# EasyEDA Pro project TY_FC_13.eprj

# Schematic Schematic1
Board Name: Board1; Create Date: 2026-01-26; Page Name: P1; Project Name: TY_FC_13; Schematic Name: Schematic1; Update Date: 2026-05-01; Company: 嘉立创EDA; Page Size: A4; Version: V1.0
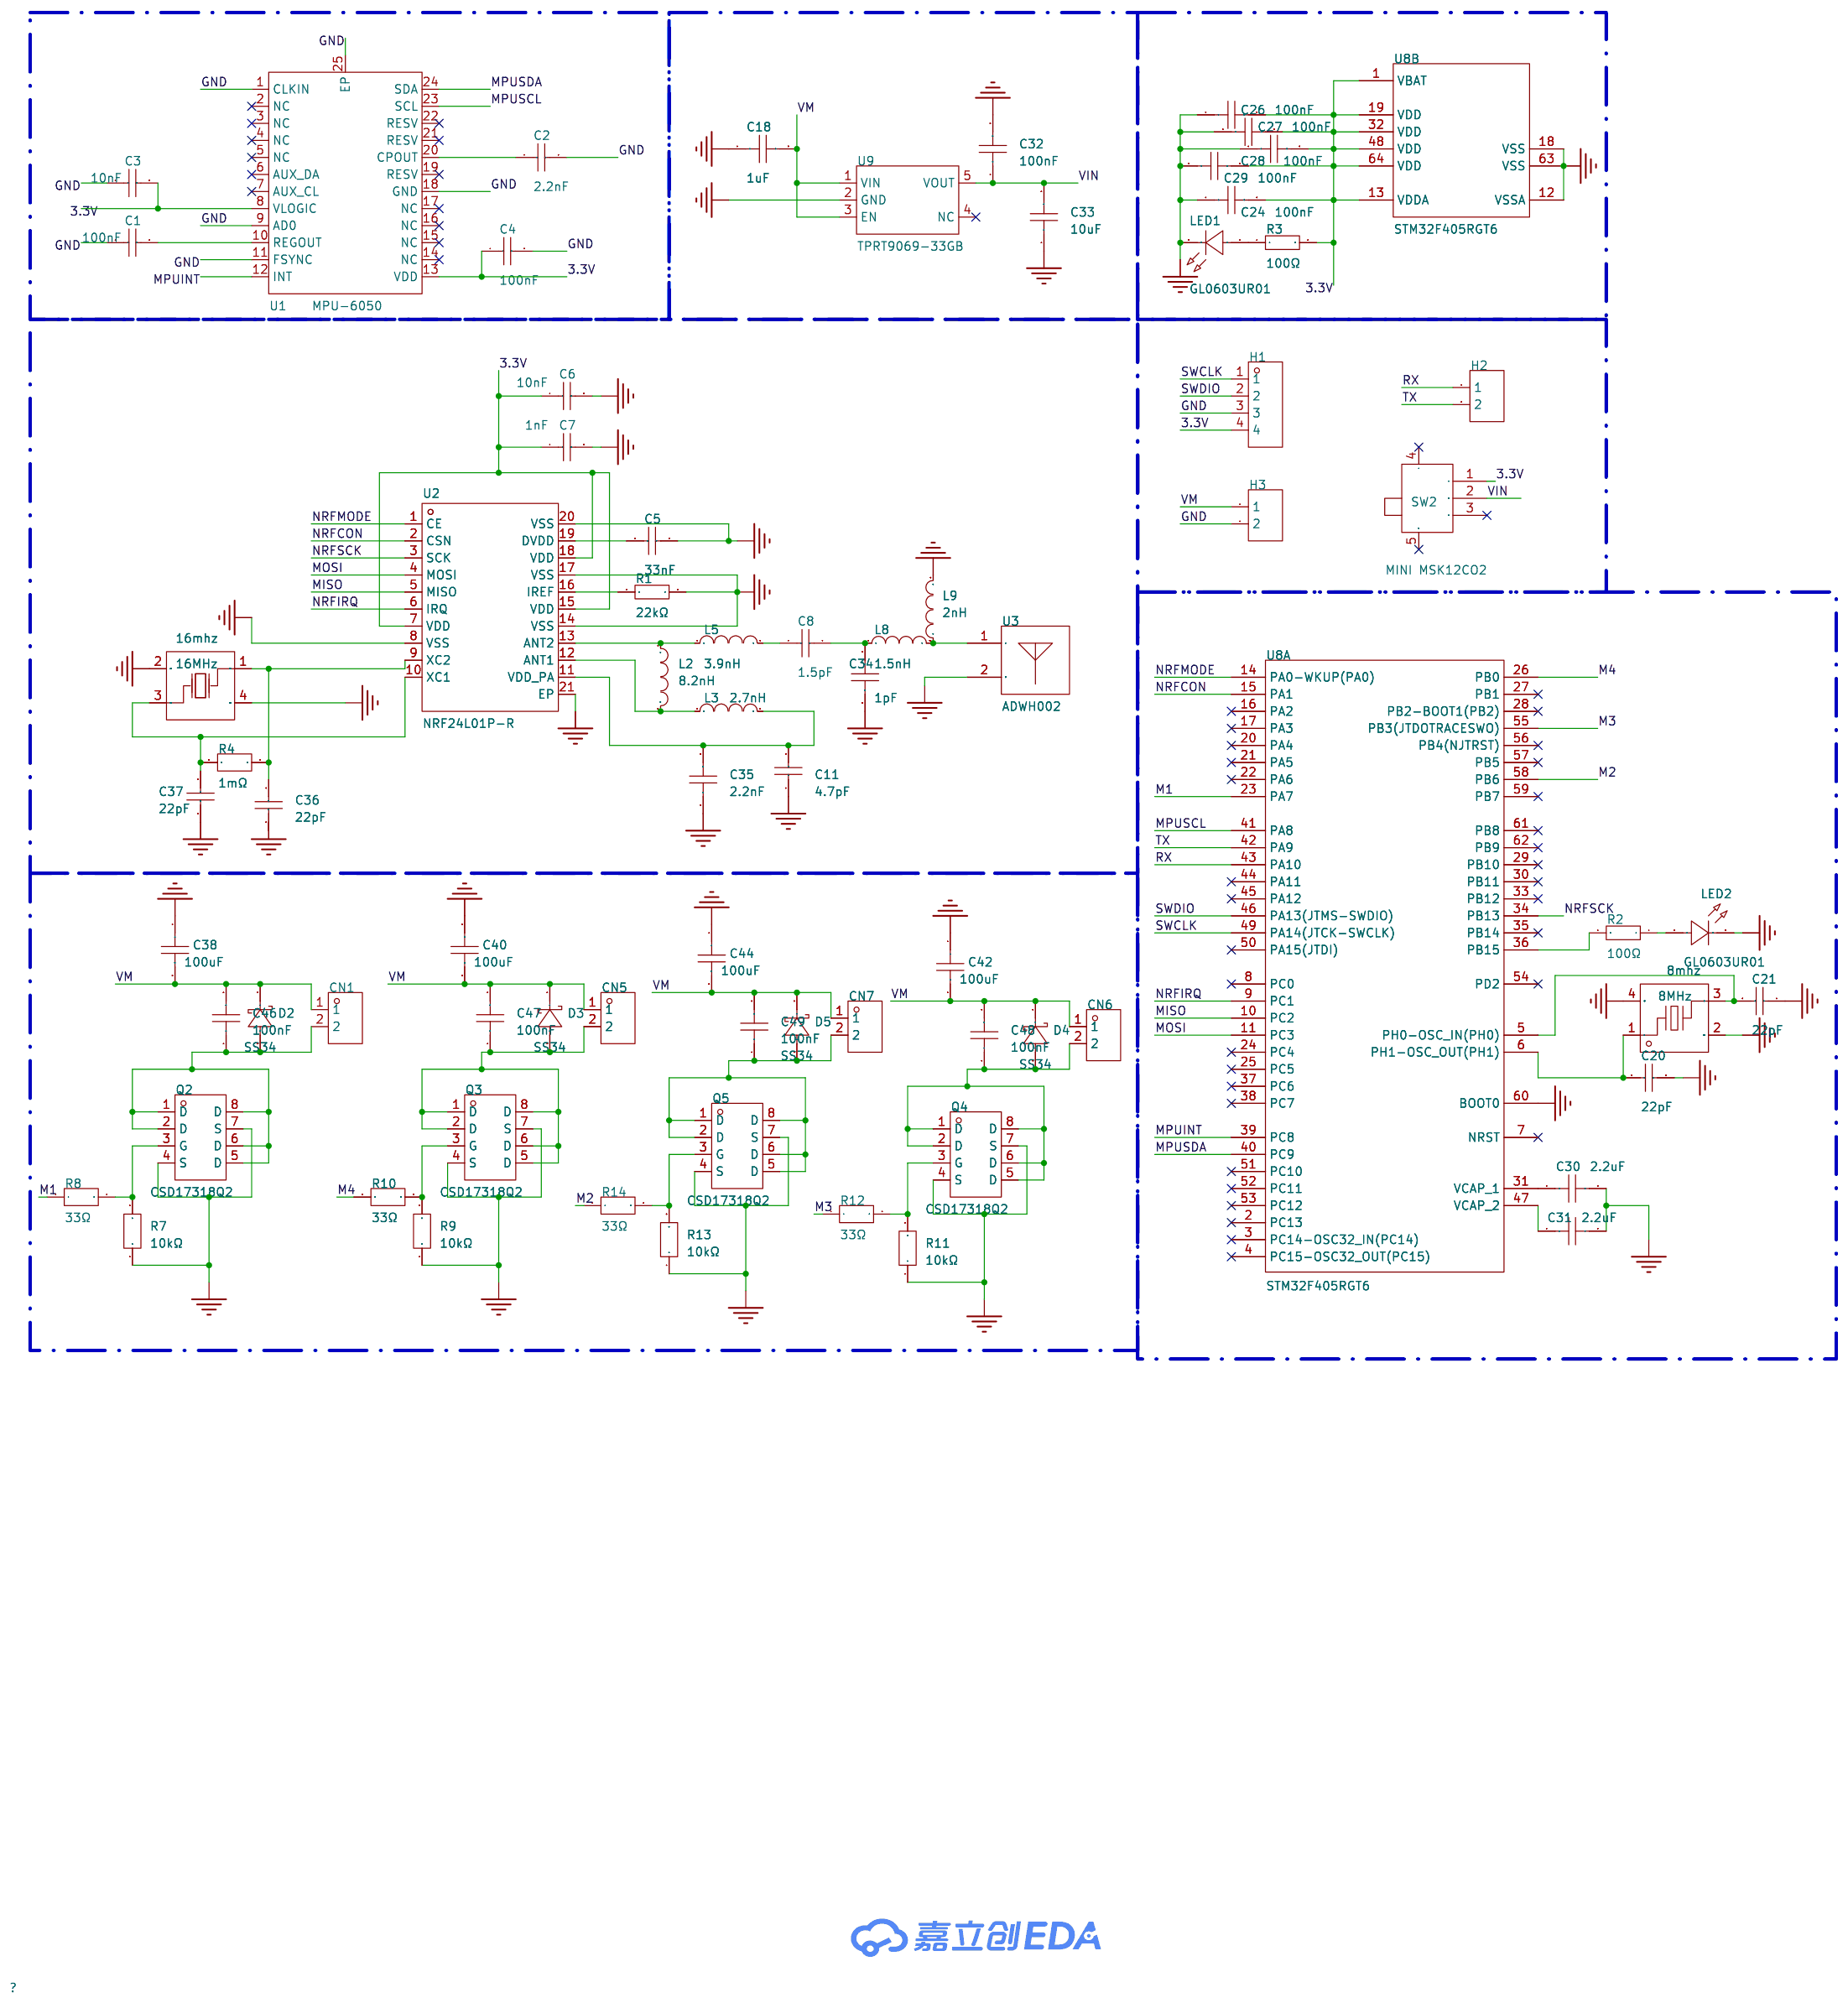
[diagram p0: schematic sheet]

## Parts
8mhz  8MHz  [CRYSTAL-SMD_4P-L3.2-W2.5-BL]
16mhz  16MHz  [OSC-SMD_4P-L3.2-W2.5-BL]
C1  100nF  [C0805]
C2  2.2nF  [C0805]
C3  10nF  [C0805]
C4  100nF  [C0805]
C5  33nF  [C0603]
C6  10nF  [C0603]
C7  1nF  [C0603]
C8  1.5pF  [C0603]
C11  4.7pF  [C0603]
C18  1uF  [C0603]
C20  22pF  [C0603]
C21  22pF  [C0603]
C24  100nF  [C0603]
C26  100nF  [C0603]
C27  100nF  [C0603]
C28  100nF  [C0603]
C29  100nF  [C0603]
C30  2.2uF  [C0603]
C31  2.2uF  [C0603]
C32  100nF  [C0603]
C33  10uF  [C0603]
C34  1pF  [C0603]
C35  2.2nF  [C0603]
C36  22pF  [C0603]
C37  22pF  [C0603]
C38  100uF  [C1206]
C40  100uF  [C1206]
C42  100uF  [C1206]
C44  100uF  [C1206]
C46  100nF  [C0603]
C47  100nF  [C0603]
C48  100nF  [C0603]
C49  100nF  [C0603]
CN1  530480210  [CONN-TH_530480210]
CN5  530480210  [CONN-TH_530480210]
CN6  530480210  [CONN-TH_530480210]
CN7  530480210  [CONN-TH_530480210]
D2  SS34  [SMA_L4.3-W2.6-LS5.0-FD]
D3  SS34  [SMA_L4.3-W2.6-LS5.0-FD]
D4  SS34  [SMA_L4.3-W2.6-LS5.0-FD]
D5  SS34  [SMA_L4.3-W2.6-LS5.0-FD]
H1  -  [HDR-TH_4P-P2.54-V-F]
H2  -  [HDR-TH_2P-P2.54-V-F]
H3  -  [HDR-TH_2P-P2.54-V-F]
L2  8.2nH  [L0402]
L3  2.7nH  [L0402]
L5  3.9nH  [L0402]
L8  1.5nH  [L0603]
L9  2nH  [L0603]
LED1  GL0603UR01  [LED0603-FD]
LED2  GL0603UR01  [LED0603-FD]
Q2  CSD17318Q2  [WSON-6_L2.0-W2.0-P0.65-TL_CSD19538Q2]
Q3  CSD17318Q2  [WSON-6_L2.0-W2.0-P0.65-TL_CSD19538Q2]
Q4  CSD17318Q2  [WSON-6_L2.0-W2.0-P0.65-TL_CSD19538Q2]
Q5  CSD17318Q2  [WSON-6_L2.0-W2.0-P0.65-TL_CSD19538Q2]
R1  22kΩ  [R0603]
R2  100Ω  [R0603]
R3  100Ω  [R0603]
R4  1mΩ  [R0603]
R7  10kΩ  [R0603]
R8  33Ω  [R0603]
R9  10kΩ  [R0603]
R10  33Ω  [R0603]
R11  10kΩ  [R0603]
R12  33Ω  [R0603]
R13  10kΩ  [R0603]
R14  33Ω  [R0603]
SW2  MINI MSK12CO2  [SW-SMD_MSK12CO2]
U1  MPU-6050  [QFN-24_L4.0-W4.0-P0.50-BL-EP2.7]
U2  NRF24L01P-R  [QFN-20_L4.0-W4.0-P0.50-BL-EP]
U3  ADWH002  [ANT-SMD_L5.0-W2.0_HM5B]
U8  STM32F405RGT6  [LQFP-64_L10.0-W10.0-P0.50-LS12.0-BL]  (sections 1,2)
U9  TPRT9069-33GB  [SOT-23-5_L3.0-W1.7-P0.95-LS2.8-BR]

## Library data of the parts
8mhz = X32258MSB4SI: LCSC Part Name: YSX321SL 8MHZ 4P 3225 20PF ±10PPM -40~85℃ (±20PPM); Supplier Part: C2682774; Manufacturer: YXC(扬兴晶振); Supplier Footprint: SMD3225-4P; JLCPCB Part Class: 扩展库; Datasheet: https://item.szlcsc.com/datasheet/X32258MSB4SI/2777871.html; Supplier: LCSC; Type: 贴片晶振; Normal temperature Frequency Tolerance: ±10ppm; Load Capacitance: 20pF; Frequency Stability: ±20ppm; Equivalent Series Resistance(ESR): 120Ω; Operating Temperature: -40℃~+85℃
16mhz = X322516MLB4SI: LCSC Part Name: YSX321SL 16MHZ 4P 3225 9PF ±10PPM -40~85℃ (±20PPM); Supplier Part: C13738; Manufacturer: YXC(扬兴晶振); Supplier Footprint: SMD3225-4P; JLCPCB Part Class: 基础库; Datasheet: https://item.szlcsc.com/datasheet/X322516MLB4SI/14393.html; Supplier: LCSC; Type: 贴片晶振; Normal temperature Frequency Tolerance: ±10ppm; Load Capacitance: 9pF; Frequency Stability: ±20ppm; Operating Temperature: -40℃~+85℃
C1 C4 = CL21B104KCFNNNE: 容值:100nF;精度:±10%;额定电压:100V;温度系数:X7R;; LCSC Part Name: 100nF ±10% 100V; Supplier Part: C28233; Manufacturer: SAMSUNG(三星); Supplier Footprint: 0805; JLCPCB Part Class: 基础库; Datasheet: https://item.szlcsc.com/datasheet/CL21B104KCFNNNE/28983.html; Supplier: LCSC; Tolerance: ±10%; Voltage Rating: 100V; Temperature Coefficient: X7R
C2 = CL21C222JBFNNNE: 容值:2.2nF;精度:±5%;额定电压:50V;温度系数:C0G;; LCSC Part Name: 2.2nF ±5% 50V; Supplier Part: C28260; Manufacturer: SAMSUNG(三星); Supplier Footprint: 0805; JLCPCB Part Class: 基础库; Datasheet: https://item.szlcsc.com/datasheet/CL21C222JBFNNNE/29010.html; Supplier: LCSC; Tolerance: ±5%; Voltage Rating: 50V; Temperature Coefficient: C0G
C3 = CL21B103KBANNNC: 容值:10nF;精度:±10%;额定电压:50V;温度系数:X7R;; LCSC Part Name: 10nF ±10% 50V; Supplier Part: C1710; Manufacturer: SAMSUNG(三星); Supplier Footprint: 0805; JLCPCB Part Class: 基础库; Datasheet: https://item.szlcsc.com/datasheet/CL21B103KBANNNC/2062.html; Supplier: LCSC; Tolerance: ±10%; Voltage Rating: 50V; Temperature Coefficient: X7R
C5 = CL10B333KB8NNNC: 容值:33nF;精度:±10%;额定电压:50V;温度系数:X7R;; LCSC Part Name: 33nF ±10% 50V; Supplier Part: C21117; Manufacturer: SAMSUNG(三星); Supplier Footprint: 0603; JLCPCB Part Class: 基础库; Datasheet: https://item.szlcsc.com/datasheet/CL10B333KB8NNNC/21829.html; Supplier: LCSC; Tolerance: ±10%; Voltage Rating: 50V; Temperature Coefficient: X7R
C6 = CC0603KRX7R9BB103: 容值:10nF;精度:±10%;额定电压:50V;温度系数:X7R;; LCSC Part Name: 10nF ±10% 50V; Supplier Part: C100042; Manufacturer: YAGEO(国巨); Supplier Footprint: 0603; JLCPCB Part Class: 扩展库; Datasheet: https://item.szlcsc.com/datasheet/CC0603KRX7R9BB103/101256.html; Supplier: LCSC; Tolerance: ±10%; Voltage Rating: 50V; Temperature Coefficient: X7R
C7 = CL10B102KB8NNNC: 容值:1nF;精度:±10%;额定电压:50V;温度系数:X7R;; LCSC Part Name: 1nF ±10% 50V; Supplier Part: C1588; Manufacturer: SAMSUNG(三星); Supplier Footprint: 0603; JLCPCB Part Class: 基础库; Datasheet: https://item.szlcsc.com/datasheet/CL10B102KB8NNNC/1940.html; Supplier: LCSC; Tolerance: ±10%; Voltage Rating: 50V; Temperature Coefficient: X7R
C8 = 0603CG1R5C500NT: 容值:1.5pF;额定电压:50V;温度系数:C0G;; LCSC Part Name: ±0.25pF 1.5pF 50V; Supplier Part: C1639; Manufacturer: FH(风华); Supplier Footprint: 0603; JLCPCB Part Class: 扩展库; Datasheet: https://item.szlcsc.com/datasheet/0603CG1R5C500NT/1991.html; Supplier: LCSC; Voltage Rating: 50V; Temperature Coefficient: C0G
C11 = 0603CG4R7C500NT: 容值:4.7pF;额定电压:50V;温度系数:C0G;; LCSC Part Name: ±0.25pF 4.7pF 50V; Supplier Part: C1669; Manufacturer: FH(风华); Supplier Footprint: 0603; JLCPCB Part Class: 扩展库; Datasheet: https://item.szlcsc.com/datasheet/0603CG4R7C500NT/2021.html; Supplier: LCSC; Voltage Rating: 50V; Temperature Coefficient: C0G
C18 = CGA0603X5R105K500JT: 容值:1uF;精度:±10%;额定电压:50V;温度系数:X5R;; LCSC Part Name: 1uF ±10% 50V; Supplier Part: C6119852; Manufacturer: HRE(芯声); Supplier Footprint: 0603; JLCPCB Part Class: 扩展库; Datasheet: https://item.szlcsc.com/datasheet/CGA0603X5R105K500JT/7062558.html; Supplier: LCSC; Tolerance: ±10%; Voltage Rating: 50V; Temperature Coefficient: X5R
C20 C21 C36 C37 = CL10C220JB8NNNC: 容值:22pF;精度:±5%;额定电压:50V;温度系数:C0G;; LCSC Part Name: 22pF ±5% 50V; Supplier Part: C1653; Manufacturer: SAMSUNG(三星); Supplier Footprint: 0603; JLCPCB Part Class: 基础库; Datasheet: https://item.szlcsc.com/datasheet/CL10C220JB8NNNC/2005.html; Supplier: LCSC; Tolerance: ±5%; Voltage Rating: 50V; Temperature Coefficient: C0G
C24 C26-C29 C46-C49 = CGA0603X7R104K500JT: 容值:100nF;精度:±10%;额定电压:50V;温度系数:X7R;; LCSC Part Name: 100nF ±10% 50V; Supplier Part: C6119867; Manufacturer: HRE(芯声); Supplier Footprint: 0603; JLCPCB Part Class: 扩展库; Datasheet: https://item.szlcsc.com/datasheet/CGA0603X7R104K500JT/7062573.html; Supplier: LCSC; Tolerance: ±10%; Voltage Rating: 50V; Temperature Coefficient: X7R
C30 C31 = CL10A225KB8NNNC: 容值:2.2uF;精度:±10%;额定电压:50V;温度系数:X5R;; LCSC Part Name: 2.2uF ±10% 50V; Supplier Part: C913904; Manufacturer: SAMSUNG(三星); Supplier Footprint: 0603; JLCPCB Part Class: 扩展库; Datasheet: https://item.szlcsc.com/datasheet/CL10A225KB8NNNC/984470.html; Supplier: LCSC; Tolerance: ±10%; Voltage Rating: 50V; Temperature Coefficient: X5R
C32 = CC0603KRX7R9BB104: LCSC Part Name: 100nF ±10% 50V; Supplier Part: C14663; Manufacturer: YAGEO(国巨); Supplier Footprint: 0603; JLCPCB Part Class: 基础库; Datasheet: https://item.szlcsc.com/datasheet/CC0603KRX7R9BB104/15331.html; Supplier: LCSC; Tolerance: ±10%; Voltage Rating: 50V; Temperature Coefficient: X7R
C33 = CGA0603X5R106K100JT: LCSC Part Name: 10uF ±10% 10V; Supplier Part: C6119842; Manufacturer: HRE(芯声); Supplier Footprint: 0603; JLCPCB Part Class: 扩展库; Datasheet: https://item.szlcsc.com/datasheet/CGA0603X5R106K100JT/7062548.html; Supplier: LCSC; Tolerance: ±10%; Voltage Rating: 10V; Temperature Coefficient: X5R
C34 = CL10C010BB8NNNC: LCSC Part Name: ±0.1pF 1pF 50V; Supplier Part: C307493; Manufacturer: SAMSUNG(三星); Supplier Footprint: 0603; JLCPCB Part Class: 扩展库; Datasheet: https://item.szlcsc.com/datasheet/CL10C010BB8NNNC/291167.html; Supplier: LCSC; Voltage Rating: 50V; Temperature Coefficient: C0G
C35 = FCC0603B222K500CT: LCSC Part Name: 2.2nF ±10% 50V; Supplier Part: C5137562; Manufacturer: FOJAN(富捷); Supplier Footprint: 0603; JLCPCB Part Class: 扩展库; Datasheet: https://item.szlcsc.com/datasheet/FCC0603B222K500CT/5747014.html; Supplier: LCSC; Tolerance: ±10%; Voltage Rating: 50V; Temperature Coefficient: X7R
C38 C40 C42 C44 = HGC1206R5107M100NSPJ: LCSC Part Name: 100uF ±20% 10V; Supplier Part: C7432784; Manufacturer: Chinocera(华瓷); Supplier Footprint: 1206; JLCPCB Part Class: 扩展库; Datasheet: https://item.szlcsc.com/datasheet/HGC1206R5107M100NSPJ/8438266.html; Supplier: LCSC; Tolerance: ±20%; Voltage Rating: 10V; Temperature Coefficient: X5R
CN1 CN5-CN7 = 530480210: 插针结构:1x2P;间距:1.25mm;安装方式:弯插;参考系列:PicoBlade(MX 1.25);总PIN数:2P;排数:1;每排PIN数:2;行距:-;额定电流:1A;触头材质:磷青铜;触头镀层:锡;工作温度:-40℃~+85℃;; LCSC Part Name: 1x2P 间距:1.25mm 弯插 系列:PicoBlade(MX 1.25); Supplier Part: C505099; Manufacturer: MOLEX; Supplier Footprint: 弯插,P=1.25mm; JLCPCB Part Class: 扩展库; Datasheet: https://www.molex.com/content/dam/molex/molex-dot-com/products/automated/en-us/salesdrawingpdf/530/53048/530480210_sd.pdf?inline\; Supplier: LCSC; Pins Structure: 1x2P; Pitch: 1.25mm; Mounting Type: 弯插; Reference Series: PicoBlade(MX 1.25); Number of Pins: 2P; Number of Rows: 1; Number of PINs Per Row: 2; Current Rating: 1A; Contact Material: 磷青铜; Contact Plating: 锡; Operating Temperature: -40℃~+85℃; Voltage Rating: 125V; Plastic Material: PA; Flame Retardant Rating: UL94V-0; Color: 白色; Z-Height of the Board: 3.5mm; X-Length of Bottom Edge on Board (Spacing Line): 4.25mm; Y-Width of Bottom Edge on Board: 5.5mm
D2-D5 = SS34_C7420365: LCSC Part Name: 电压:40V 电流:3A; Supplier Part: C7420365; Manufacturer: R+O(宏嘉诚); Supplier Footprint: SMA(DO-214AC); JLCPCB Part Class: 扩展库; Datasheet: https://item.szlcsc.com/datasheet/SS34/8397187.html; Supplier: LCSC; Diode Configuration: 独立式; Voltage - Forward(Vf@If): 550mV@3A; Voltage - DC Reverse(Vr): 40V; Current - Rectified: 3A; Reverse Leakage Current (Ir): 200uA@40V
H1 = HDR-F_2.54_1x4P: Supplier Part: C2718488; Supplier Footprint: 插件
H2 H3 = HDR-F_2.54_1x2P: Supplier Part: C49661; Supplier Footprint: 插件
L2 = SDCL1005C8N2JTDF: 电感值:8.2nH;精度:±5%;额定电流:300mA;饱和电流(Isat):-;直流电阻(DCR):400mΩ;; LCSC Part Name: 8.2nH ±5%; Supplier Part: C16208; Manufacturer: Sunlord(顺络); Supplier Footprint: 0402; JLCPCB Part Class: 扩展库; Datasheet: https://item.szlcsc.com/datasheet/SDCL1005C8N2JTDF/16890.html; Supplier: LCSC; Tolerance: ±5%; Current Rating: 300mA; DC Resistance(DCR): 400mΩ; Q @ Frequency: 8@100MHz; Frequency - Self Resonant: 3.6GHz
L3 = LQG15HS2N7S02D: 电感值:2.7nH;精度:-;额定电流:800mA;饱和电流(Isat):-;直流电阻(DCR):120mΩ;; LCSC Part Name: ±0.3nH 2.7nH; Supplier Part: C77108; Manufacturer: muRata(村田); Supplier Footprint: 0402; JLCPCB Part Class: 扩展库; Datasheet: https://item.szlcsc.com/datasheet/LQG15HS2N7S02D/78235.html; Supplier: LCSC; Current Rating: 800mA; DC Resistance(DCR): 120mΩ; Q @ Frequency: 8@100MHz; Frequency - Self Resonant: 6GHz
L5 = SDCL1005C3N9STDF: LCSC Part Name: ±0.3nH 3.9nH; Supplier Part: C14033; Manufacturer: Sunlord(顺络); Supplier Footprint: 0402; JLCPCB Part Class: 扩展库; Datasheet: https://item.szlcsc.com/datasheet/SDCL1005C3N9STDF/14690.html; Supplier: LCSC; Current Rating: 300mA; DC Resistance(DCR): 200mΩ; Q @ Frequency: 8@100MHz; Frequency - Self Resonant: 4GHz
L8 = LQG18HN1N5S00D: LCSC Part Name: 1.5nH ±0.3nH; Supplier Part: C882495; Manufacturer: muRata(村田); Supplier Footprint: 0603; JLCPCB Part Class: 扩展库; Datasheet: https://atta.szlcsc.com/upload/public/pdf/source/20201228/C882495_224F3764FCADED3FCD37F8C25FAFFA7A.pdf; Supplier: LCSC; Rated Current: 1.1A; DC Resistance (DCR): 100mΩ; Q @ Freq: 12@100MHz; Frequency - Self Resonant: 6GHz; Type: 叠层电感
L9 = SDCL1608C2N0STDF: Supplier Part: C370234; Manufacturer: Sunlord(顺络); Supplier Footprint: 0603; JLCPCB Part Class: 扩展库; Datasheet: https://item.szlcsc.com/datasheet/SDCL1608C2N0STDF/343985.html; Supplier: LCSC
LED1 LED2 = GL0603UR01: 发光颜色:红色;正向压降(Vf):2.4V;正向电流:20mA;波长:620nm~625nm;二极管配置:独立二极管;透镜颜色:无色透明透镜;发光强度:120mcd;发光角度:120°;载带方式:正贴;工作温度:-40℃~+85℃;; LCSC Part Name: 0603 红灯 高亮; Supplier Part: C51933292; Manufacturer: Guiguang light(桂光光电); Supplier Footprint: 0603; JLCPCB Part Class: 扩展库; Datasheet: https://item.szlcsc.com/datasheet/GL0603UR01/54645988.html; Supplier: LCSC; Illumination Color: 红色; Voltage - Forward(Vf): 2.4V; Forward Current: 20mA; Wavelength - Dominant: 620nm~625nm; Diode Configuration: 独立二极管; Lens Color: 无色透明透镜; Luminous Intensity: 120mcd; Viewing Angle: 120°; Mounting Style: 正贴; Operating Temperature: -40℃~+85℃
Q2-Q5 = CSD17318Q2: LCSC Part Name: 1个N沟道 耐压:30V 电流:25A; Supplier Part: C2862001; Manufacturer: TI(德州仪器); Supplier Footprint: WSON-6(2x2); JLCPCB Part Class: 扩展库; Datasheet: https://www.ti.com/cn/lit/gpn/csd17318q2; Supplier: LCSC; Number: 1个N沟道; Drain to Source Voltage: 30V; Current - Continuous Drain(Id): 25A; RDS(on): 15.1mΩ@8V,8A; Pd - Power Dissipation: 16W; Gate Threshold Voltage (Vgs(th)): 1.2V; Gate Charge(Qg): 6nC@4.5V; Input Capacitance(Ciss): 879pF@15V; Operating Temperature: -55℃~+150℃@(Tj)
R1 = 0603WAF2202T5E: 电阻类型:厚膜电阻;阻值:22kΩ;精度:±1%;功率:100mW;工作电压:75V;温度系数:±100ppm/℃;; LCSC Part Name: 22kΩ ±1% 100mW 厚膜电阻; Supplier Part: C31850; Manufacturer: UNI-ROYAL(厚声); Supplier Footprint: 0603; JLCPCB Part Class: 基础库; Datasheet: https://item.szlcsc.com/datasheet/0603WAF2202T5E/32812.html; Supplier: LCSC; Type: 厚膜电阻; Tolerance: ±1%; Power(Watts): 100mW; Voltage-Supply(Max): 75V; Temperature Coefficient: ±100ppm/℃; Operating Temperature: -55℃~+155℃
R2 R3 = 0603WAF1000T5E: 电阻类型:厚膜电阻;阻值:100Ω;精度:±1%;功率:100mW;最大工作电压:75V;温度系数:±200ppm/℃;; LCSC Part Name: 100Ω ±1% 100mW 厚膜电阻; Supplier Part: C22775; Manufacturer: UNI-ROYAL(厚声); Supplier Footprint: 0603; JLCPCB Part Class: 基础库; Datasheet: https://atta.szlcsc.com/upload/public/pdf/source/20200306/C422600_1E6D84923E4A46A82E41ADD87F860B5C.pdf; Supplier: LCSC; Type: 厚膜电阻; Tolerance: ±1%; Power(Watts): 100mW; Overload Voltage (Max): 75V; Temperature Coefficient: ±200ppm/℃; Operating Temperature Range: -55℃~+155℃
R4 = PA0603FRP070R001L: LCSC Part Name: 1mΩ ±1% 100mW; Supplier Part: C6949223; Manufacturer: YAGEO(国巨); Supplier Footprint: 0603; JLCPCB Part Class: 扩展库; Datasheet: https://item.szlcsc.com/datasheet/PA0603FRP070R001L/7915052.html; Supplier: LCSC; Tolerance: ±1%; Power(Watts): 100mW; Temperature Coefficient: ±300ppm/℃; Operating Temperature: -55℃~+155℃
R7 R9 R11 R13 = FRC0603F1002TS: LCSC Part Name: 10kΩ ±1% 100mW 厚膜电阻; Supplier Part: C2906982; Manufacturer: FOJAN(富捷); Supplier Footprint: 0603; JLCPCB Part Class: 扩展库; Supplier: LCSC; Type: 厚膜电阻; Tolerance: ±1%; Power(Watts): 100mW; Voltage-Supply(Max): 75V; Temperature Coefficient: ±100ppm/℃; Operating Temperature: -55℃~+155℃
R8 R10 R12 R14 = FRC0603F33R0TS: LCSC Part Name: 33Ω ±1% 100mW 厚膜电阻; Supplier Part: C2909394; Manufacturer: FOJAN(富捷); Supplier Footprint: 0603; JLCPCB Part Class: 扩展库; Supplier: LCSC; Type: 厚膜电阻; Tolerance: ±1%; Power(Watts): 100mW; Voltage-Supply(Max): 75V; Temperature Coefficient: ±100ppm/℃; Operating Temperature: -55℃~+155℃
SW2 = MINI MSK12CO2: 电路结构:单刀双掷;安装方式:卧贴;开关颜色:白色;额定电流:50mA;额定电压:12V;工作寿命:1万次;; LCSC Part Name: MSK12C02 MINI白柄1.5 编带; Supplier Part: C2681570; Manufacturer: SHOU HAN(首韩); Supplier Footprint: SMD,5x2.8mm; JLCPCB Part Class: 扩展库; Datasheet: https://item.szlcsc.com/datasheet/MINI%2520MSK12CO2/2774913.html; Supplier: LCSC; Circuit: 单刀双掷; Actuator Style: 矩形柱状; Termination Style: SMD接片; Length: 5mm; Width: 2.75mm; Switch Height: 1.4mm; Mounting Type: 卧贴; Actuator Color: 白色; Current Rating: 50mA; Voltage Rating: 12V; Life: 1万次; Operating Temperature: -25℃~+70℃
U1 = MPU-6050: 传感器类型:加速度计陀螺仪;; Supplier Part: C24112; Manufacturer: TDK InvenSense(应美盛); Supplier Footprint: QFN-24-EP(4x4); JLCPCB Part Class: 扩展库; Datasheet: https://item.szlcsc.com/datasheet/MPU-6050/24852.html; Supplier: LCSC; Sensor Type: 加速度计陀螺仪; Operating Temperature: -40℃~+85℃
U2 = NRF24L01P-R: 频率范围:2.4GHz~2.525GHz;接口类型:SPI;应用领域:ISM;数据速率:2Mbps;灵敏度:-82dBm;典型应用频率:2.4GHz;; LCSC Part Name: 单芯片2.4GHz收发器; Supplier Part: C8791; Manufacturer: NORDIC; Supplier Footprint: QFN-20-EP(4x4); JLCPCB Part Class: 扩展库; Datasheet: https://item.szlcsc.com/datasheet/NRF24L01P-R/9305.html; Supplier: LCSC; Frequency Range: 2.4GHz~2.525GHz; Interface: SPI; Voltage - Supply: 1.9V~3.6V; Applications: ISM; Output Power: 0dBm; Data Rate: 2Mbps; Current Of Transmitting: 11.3mA; Sensitivity: -82dBm; Receive Current: 13.5mA; Typical Application Frequency: 2.4GHz; Operating Temperature: -40℃~+85℃; Type: 收发器
U3 = ADWH002: 天线类型:-;中心频率:2.45GHz;带宽:100MHz;增益:0.67dBi;功率:3W;驻波比:2;; LCSC Part Name: 2.4GHz SMD贴片天线 蓝牙/WiFi/zigbee芯片天线 大款; Supplier Part: C22467691; Manufacturer: MyAntenna(摩天射频); Supplier Footprint: SMD; JLCPCB Part Class: 扩展库; Datasheet: https://item.szlcsc.com/datasheet/ADWH002/24170586.html; Supplier: LCSC; Frequency(Center/Band): 2.45GHz; Bandwidth: 100MHz; Peak Gain: 0.67dBi; Impedance: 50Ω; Power: 3W; VSWR: 2; Operating Temperature: -40℃~+85℃; Length: 5mm; Width: 2mm; Height: 1mm
U8 = STM32F405RGT6: CPU内核:ARM-M4;CPU最大主频:168MHz;应用领域:-;; LCSC Part Name: 带DSP和FPU的高性能基础系列ARM Cortex-M4 MCU，具有1 MB Flash、168 MHz CPU和ART加速器; Supplier Part: C15742; Manufacturer: ST(意法半导体); Supplier Footprint: LQFP-64(10x10); JLCPCB Part Class: 扩展库; Datasheet: https://item.szlcsc.com/datasheet/STM32F405RGT6/16424.html; Supplier: LCSC; CPU Core: ARM-M4; CPU Maximum Speed: 168MHz; Program Storage Size: 1MB; Program Memory Type: FLASH; Number of I/O: 51; ADC (Bit): 12bit; DAC (Bit): 12bit; Voltage - Supply: 1.8V~3.6V
U9 = TPRT9069-33GB: LCSC Part Name: LDO; Supplier Part: C2937034; Manufacturer: TECH PUBLIC(台舟); Supplier Footprint: SOT-23-5; JLCPCB Part Class: 扩展库; Datasheet: https://item.szlcsc.com/datasheet/TPRT9069-33GB/3290381.html; Supplier: LCSC; Output Type: 固定; Voltage - Supply: 36V; Output Voltage: 3.3V; Output Current: 200mA; Power Supply Rejection Ratio (PSRR): 70dB@(100Hz); Voltage Dropout: 750mV@(100mA); standby current: 2uA; Features: 过流保护；过热保护; Operating Temperature: -40℃~+85℃@(Ta); Output Configuration: 正极; Number of Outputs: 1

## Nets
3.3V: C3.2 C4.1 C6.1 C7.1 C24.2 C26.2 C27.2 C28.2 C29.2 H1.4 R3.2 SW2.1 U1.8(VLOGIC) U1.13(VDD) U2.7(VDD) U2.15(VDD) U2.18(VDD) U8.1(VBAT) U8.13(VDDA) U8.19(VDD) U8.32(VDD) U8.48(VDD) U8.64(VDD)
GND: 8mhz.2(GND) 8mhz.4(GND) 16mhz.2(GND) 16mhz.4(GND) C1.1 C2.2 C3.1 C4.2 C5.2 C6.2 C7.2 C11.1 C18.1 C20.2 C21.1 C24.1 C26.1 C27.1 C28.1 C29.1 C30.2 C31.2 C32.2 C33.1 C34.2 C35.1 C36.1 C37.1 C38.1 C40.1 C42.1 C44.1 H1.3 H3.2 L9.2 LED1.2(C) LED2.2(C) Q2.4(S) Q2.7(S) Q3.4(S) Q3.7(S) Q4.4(S) Q4.7(S) Q5.4(S) Q5.7(S) R1.2 R7.1 R9.1 R11.1 R13.1 U1.1(CLKIN) U1.9(AD0) U1.11(FSYNC) U1.18(GND) U1.25(EP) U2.8(VSS) U2.14(VSS) U2.17(VSS) U2.20(VSS) U2.21(EP) U3.2(GND) U8.12(VSSA) U8.18(VSS) U8.60(BOOT0) U8.63(VSS) U9.2(GND)
VIN: C32.1 C33.2 SW2.2 U9.5(VOUT)
M1: R8.1 U8.23(PA7)
M2: R14.1 U8.58(PB6)
M3: R12.1 U8.55(PB3(JTDOTRACESWO))
M4: R10.1 U8.26(PB0)
MISO: U2.5(MISO) U8.10(PC2)
MOSI: U2.4(MOSI) U8.11(PC3)
MPUINT: U1.12(INT) U8.39(PC8)
MPUSCL: U1.23(SCL) U8.41(PA8)
MPUSDA: U1.24(SDA) U8.40(PC9)
NRFCON: U2.2(CSN) U8.15(PA1)
NRFIRQ: U2.6(IRQ) U8.9(PC1)
NRFMODE: U2.1(CE) U8.14(PA0-WKUP(PA0))
NRFSCK: U2.3(SCK) U8.34(PB13)
RX: H2.1 U8.43(PA10)
SWCLK: H1.1 U8.49(PA14(JTCK-SWCLK))
SWDIO: H1.2 U8.46(PA13(JTMS-SWDIO))
TX: H2.2 U8.42(PA9)
VM: C18.2 C38.2 C40.2 C42.2 C44.2 C46.2 C47.2 C48.2 C49.2 CN1.1 CN5.1 CN6.1 CN7.1 D2.2(K) D3.2(K) D4.2(K) D5.2(K) H3.1 U9.1(VIN) U9.3(EN)
$1N574: C2.1 U1.20(CPOUT)
$1N1185: R1.1 U2.16(IREF)
$1N1316: C5.1 U2.19(DVDD)
$1N2240: L2.1 L5.1 U2.13(ANT2)
$1N2242: C8.1 L5.2
$1N2285: L2.2 L3.1 U2.12(ANT1)
$1N2301: C11.2 C35.2 L3.2 U2.11(VDD_PA)
$1N7003: C1.2 U1.10(REGOUT)
$1N7186: 8mhz.1 C20.1 U8.6(PH1-OSC_OUT(PH1))
$1N7190: 8mhz.3 C21.2 U8.5(PH0-OSC_IN(PH0))
$1N10822: C30.1 U8.31(VCAP_1)
$1N10858: C31.1 U8.47(VCAP_2)
$1N11078: LED2.1(A) R2.1
$1N11191: LED1.1(A) R3.1
$1N19913: R2.2 U8.36(PB15)
$1N21756: C8.2 C34.1 L8.1
$1N25381: 16mhz.1(OSC1) C36.2 R4.1 U2.9(XC2)
$1N25386: 16mhz.3(OSC2) C37.2 R4.2 U2.10(XC1)
$1N52195: L8.2 L9.1 U3.1(IN)
$1N63479: Q2.3(G) R7.2 R8.2
$1N64362: C46.1 CN1.2 D2.1(A) Q2.1(D) Q2.2(D) Q2.5(D) Q2.6(D) Q2.8(D)
$1N64796: Q3.3(G) R9.2 R10.2
$1N64805: C47.1 CN5.2 D3.1(A) Q3.1(D) Q3.2(D) Q3.5(D) Q3.6(D) Q3.8(D)
$1N65508: Q5.3(G) R13.2 R14.2
$1N65517: C49.1 CN7.2 D5.1(A) Q5.1(D) Q5.2(D) Q5.5(D) Q5.6(D) Q5.8(D)
$1N65864: Q4.3(G) R11.2 R12.2
$1N65873: C48.1 CN6.2 D4.1(A) Q4.1(D) Q4.2(D) Q4.5(D) Q4.6(D) Q4.8(D)

Not connected (* = marked no-connect by the designer): SW2 3* 4* 5*; U1 2(NC)* 3(NC)* 4(NC)* 5(NC)* 6(AUX_DA)* 7(AUX_CL)* 14(NC)* 15(NC)* 16(NC)* 17(NC)* 19(RESV)* 21(RESV)* 22(RESV)*; U8 2(PC13)* 3(PC14-OSC32_IN(PC14))* 4(PC15-OSC32_OUT(PC15))* 7(NRST)* 8(PC0)* 16(PA2)* 17(PA3)* 20(PA4)* 21(PA5)* 22(PA6)* 24(PC4)* 25(PC5)* 27(PB1)* 28(PB2-BOOT1(PB2))* 29(PB10)* 30(PB11)* 33(PB12)* 35(PB14)* 37(PC6)* 38(PC7)* 44(PA11)* 45(PA12)* 50(PA15(JTDI))* 51(PC10)* 52(PC11)* 53(PC12)* 54(PD2)* 56(PB4(NJTRST))* 57(PB5)* 59(PB7)* 61(PB8)* 62(PB9)*; U9 4(NC)*

# Board PCB2
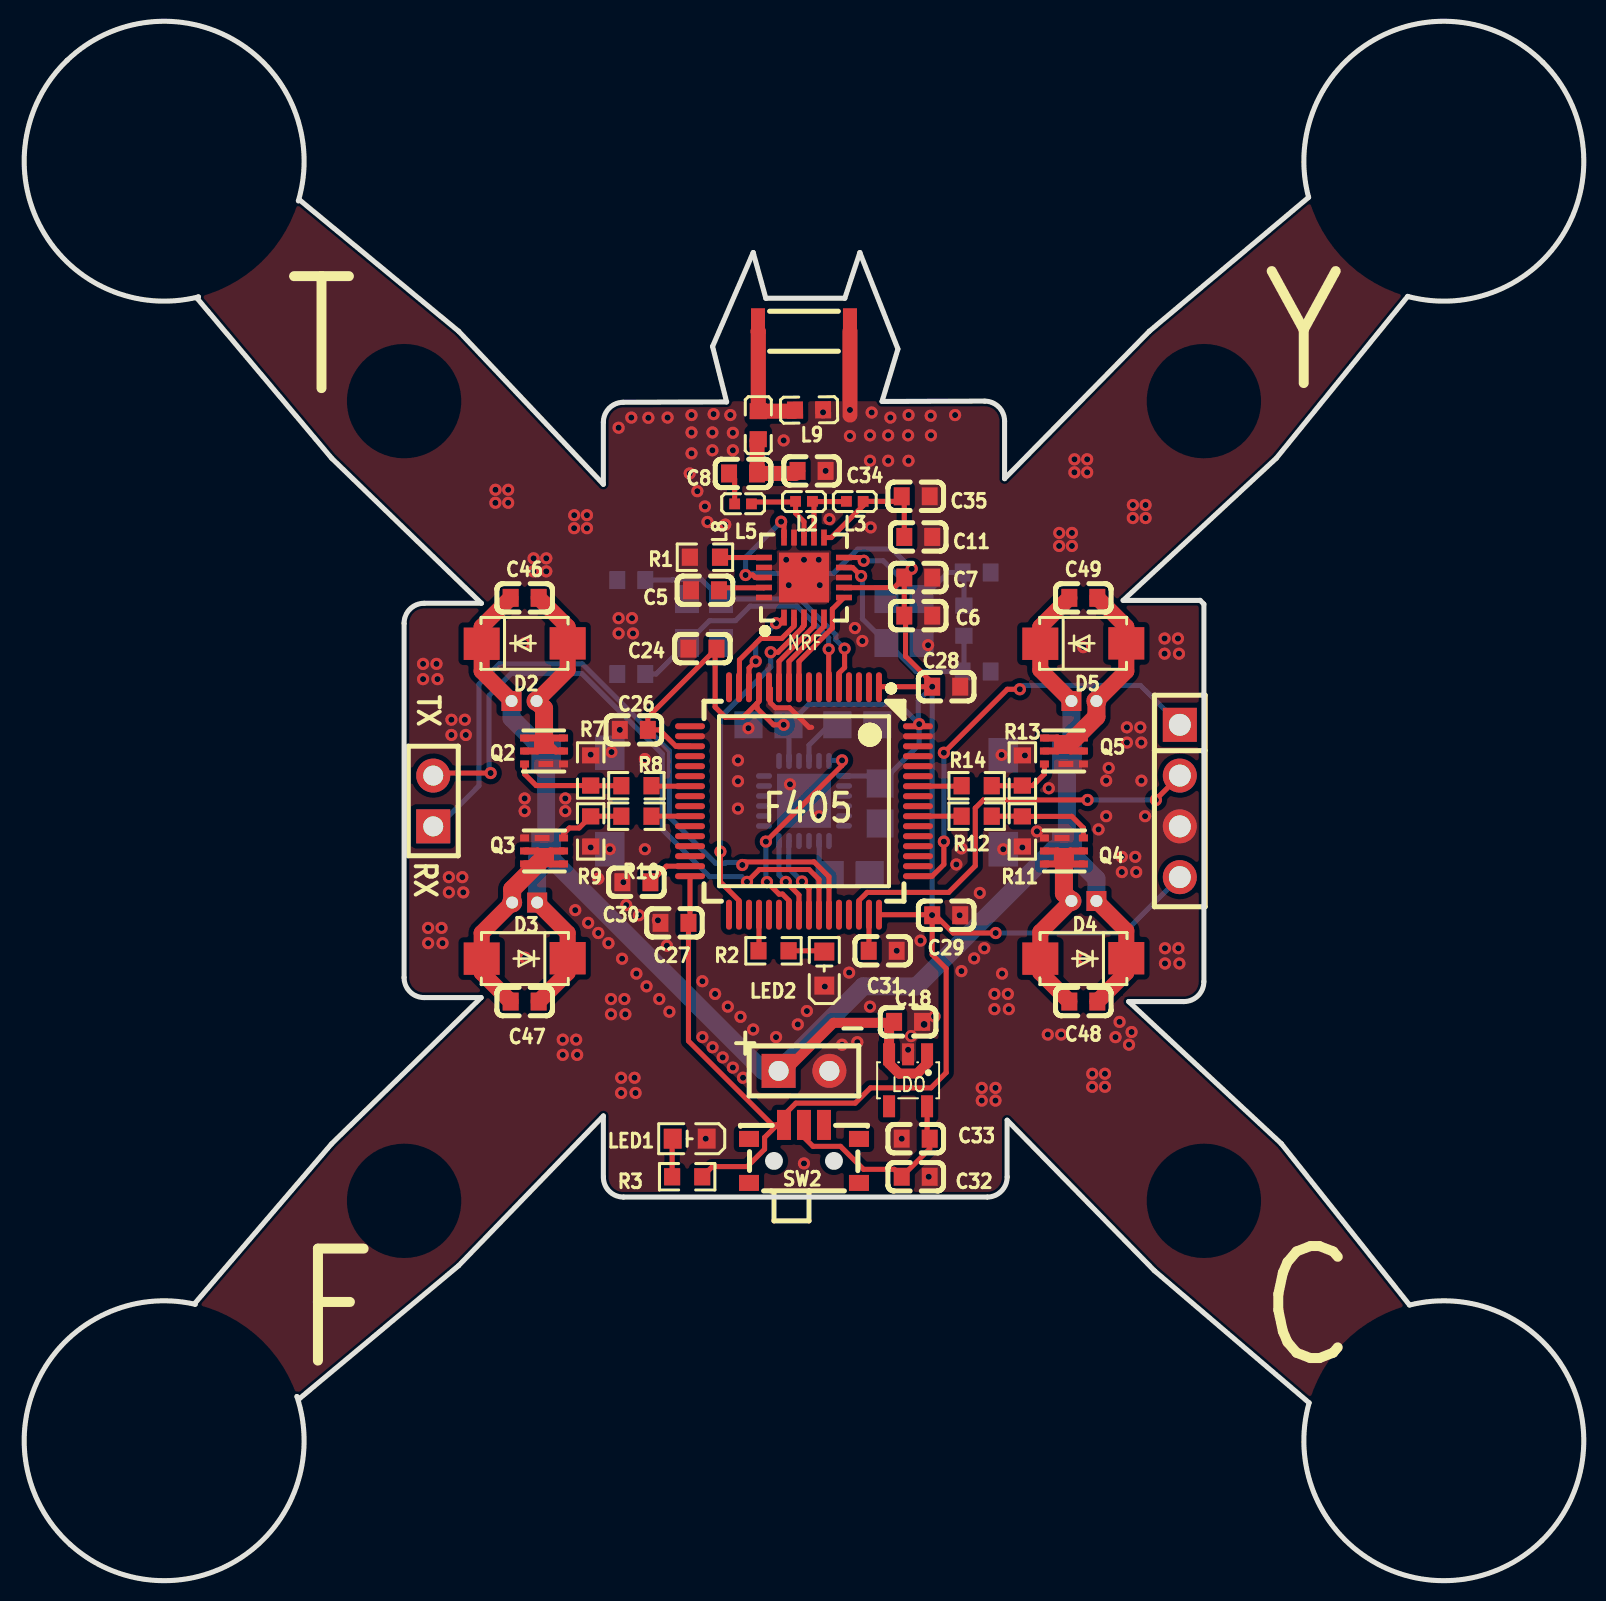
[diagram p1: board, top side]
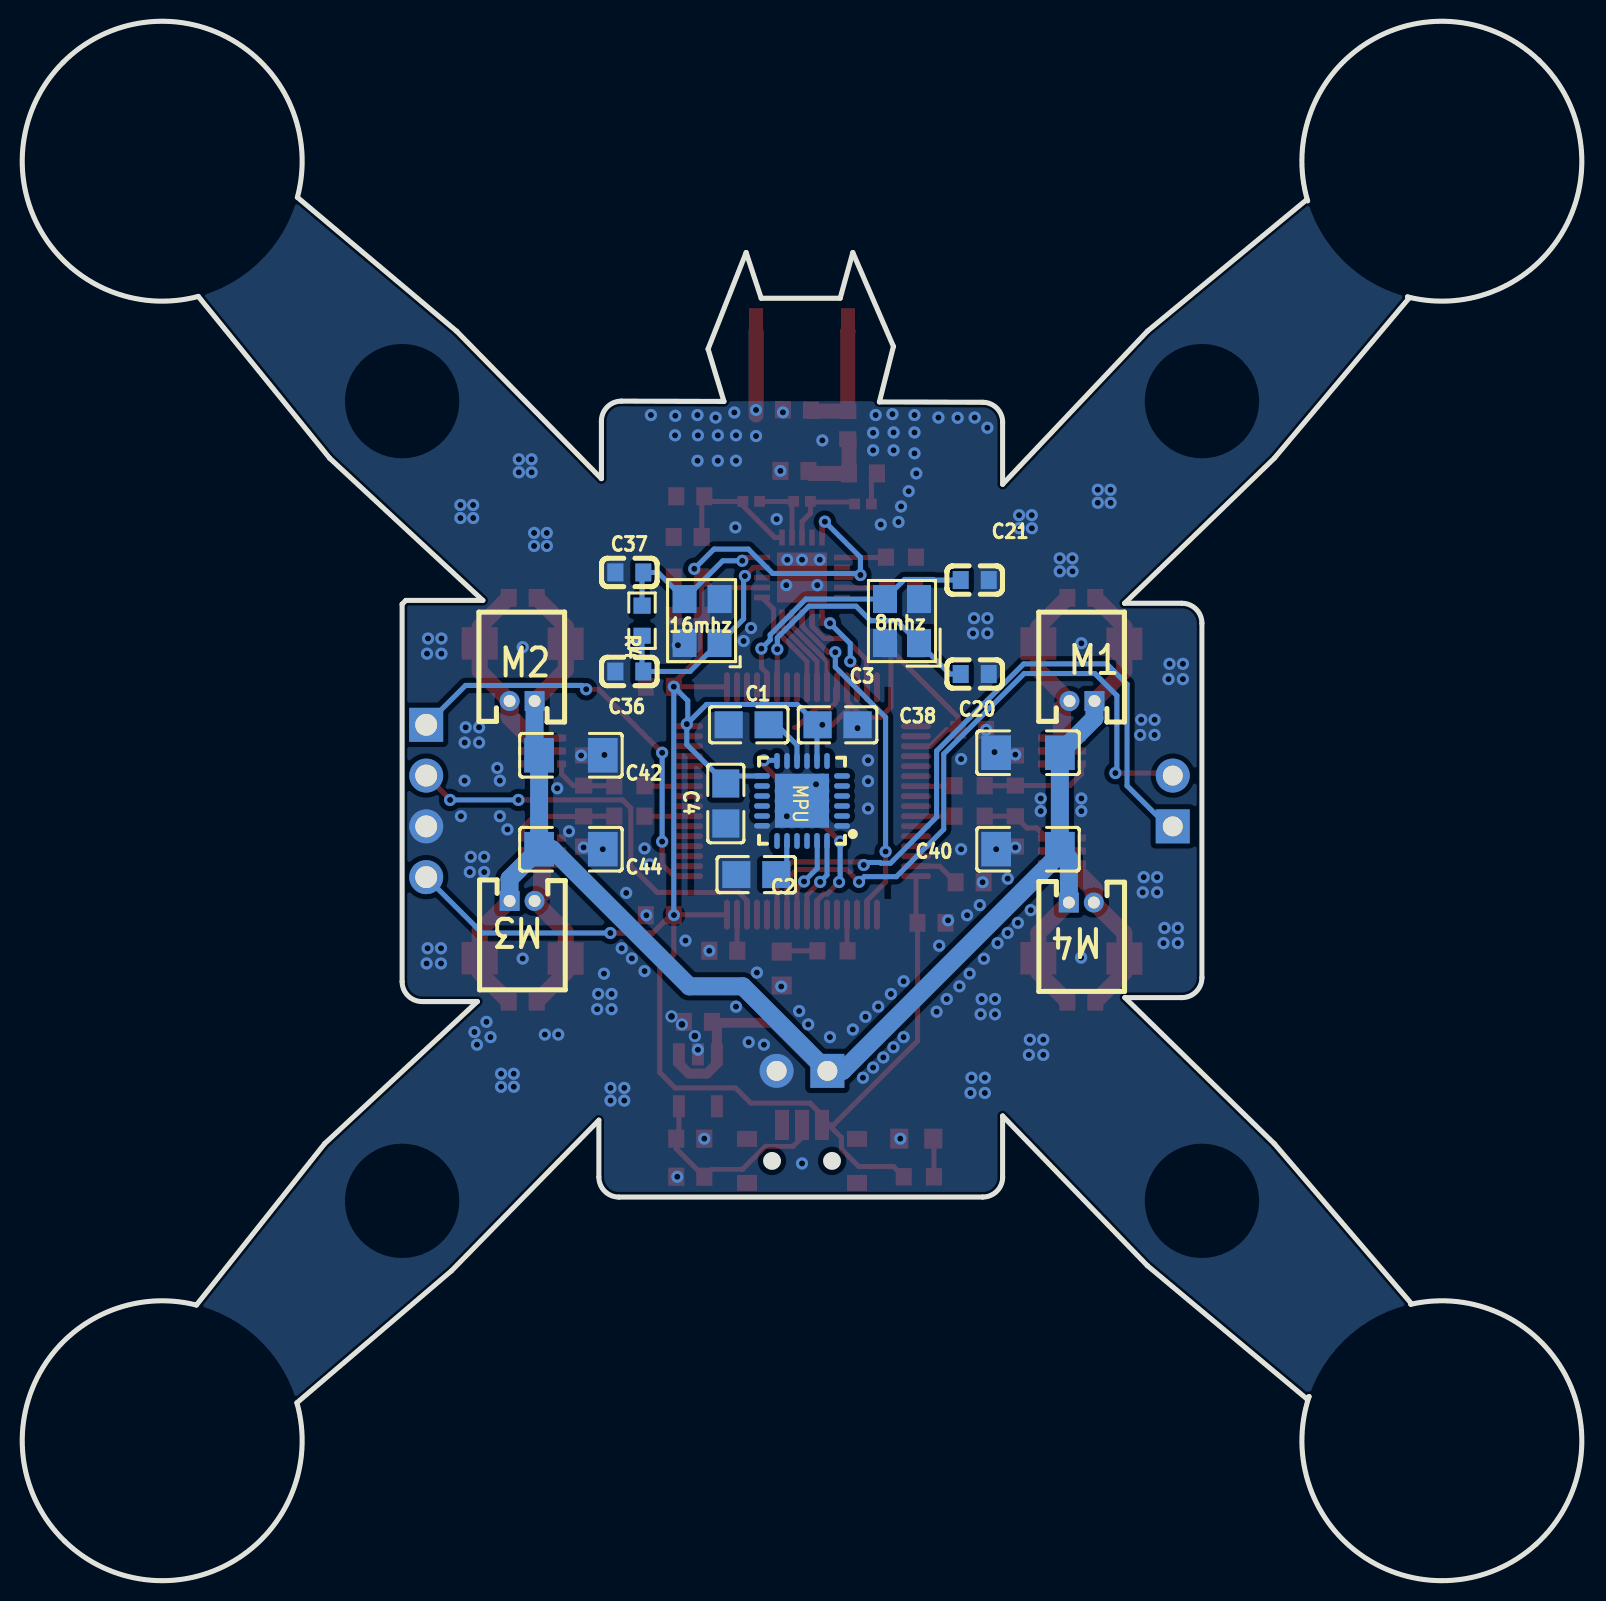
[diagram p2: board, bottom side, seen from below]

Outline 78 x 78 mm; copper layers: Top Layer, Bottom Layer. Coordinates in mm from the lower left corner of the outline.
Outline path: 2.15,76.04 arc(10.63,76.98) 13.71,69.02 13.76,69.07 21.73,62.49 28.97,54.84 28.97,57.94 arc(29.26,58.64) 29.96,58.94 35.13,58.95 34.43,61.73 36.46,66.43 37.09,64.14 41.04,64.14 41.79,66.43 43.7,61.6 42.9,58.98 48.03,59 arc(48.74,58.7) 49.03,58 49.03,55.12 56.27,62.49 64.24,69.19 arc(67.5,77.06) 75.95,75.95 arc(77.06,67.5) 69.19,64.23 62.62,56.14 54.96,49.03 58.81,49.03 59,48.84 59,29.96 arc(58.71,29.26) 58,28.96 55.24,28.96 62.87,21.85 69.29,13.78 arc(77.11,10.41) 75.88,1.98 arc(67.42,0.98) 64.26,8.89 56.52,15.5 49.16,23.03 49.16,20.18 arc(48.87,19.48) 48.16,19.18 29.97,19.18 arc(29.26,19.48) 28.97,20.18 28.97,23.24 21.73,15.75 13.76,9.1 13.64,9.21 arc(10.82,1.13) 2.3,1.81 arc(0.79,10.23) 8.55,13.82 8.52,13.85 15.38,21.85 22.85,29.16 20,29.16 arc(19.29,29.45) 19,30.16 19,47.88 arc(19.29,48.59) 20,48.88 22.87,48.88 15.38,56.14 8.65,64.14 8.72,64.21 arc(0.88,67.6) 2.15,76.04
Stack: Top Layer 0.035mm / Dielectric1 1.51mm FR4 er 4.5 / Bottom Layer 0.035mm

## Design rules (mm)
template: 自定义配置
spacing copperThickness1oz (default): track to track 0.102, other pairs 0.152 to 0.3
spacing copperThickness2oz: track to track 0.203, other pairs 0.152 to 0.3
spacing RF: track to track 0.2, other pairs 0.152 to 0.3
track width copperThickness1oz (default): min 0.127, default 0.254, max 2.54
track width copperThickness2oz: min 0.203, default 0.254, max 2.54
track width RF: min 0.75, default 0.76, max 0.77
differential pair differentialPair (default): width min 0.127, default 0.254, max 2.54; gap min 0.152, default 0.152
via viaSize (default): diameter min 0.5, default 0.61, max 10; hole min 0.3, default 0.305, max 6.3

## Placement (name value [footprint] x y rotation side)
8mhz  8MHz  [CRYSTAL-SMD_4P-L3.2-W2.5-BL]  34 48 90 bottom
16mhz  16MHz  [OSC-SMD_4P-L3.2-W2.5-BL]  44 48 90 bottom
C1  100nF  [C0805]  41.67 42.81 180 bottom
C2  2.2nF  [C0805]  41.28 35.31 0 bottom
C3  10nF  [C0805]  37.22 42.81 0 bottom
C4  100nF  [C0805]  42.81 38.87 270 bottom
C5  33nF  [C0603]  34.05 49.54 180 top
C6  10nF  [C0603]  44.71 48.27 0 top
C7  1nF  [C0603]  44.71 50.17 0 top
C8  1.5pF  [C0603]  35.95 55.38 0 top
C11  4.7pF  [C0603]  44.71 52.2 180 top
C18  1uF  [C0603]  44.21 27.95 180 top
C20  22pF  [C0603]  30.36 45.35 180 bottom
C21  22pF  [C0603]  30.36 50.04 0 bottom
C24  100nF  [C0603]  33.92 46.62 0 top
C26  100nF  [C0603]  30.49 42.55 0 top
C27  100nF  [C0603]  32.52 32.9 0 top
C28  100nF  [C0603]  46.11 44.71 180 top
C29  100nF  [C0603]  46.11 33.28 180 top
C30  2.2uF  [C0603]  30.62 34.93 180 top
C31  2.2uF  [C0603]  42.94 31.5 0 top
C32  100nF  [C0603]  44.59 20.2 0 top
C33  10uF  [C0603]  44.59 22.1 0 top
C34  1pF  [C0603]  39.38 55.51 0 top
C35  2.2nF  [C0603]  44.59 54.24 180 top
C36  22pF  [C0603]  47.63 45.47 180 bottom
C37  22pF  [C0603]  47.63 50.43 180 bottom
C38  100uF  [C1206]  27.7 41.41 180 bottom
C40  100uF  [C1206]  27.7 36.58 180 bottom
C42  100uF  [C1206]  50.56 41.28 0 bottom
C44  100uF  [C1206]  50.56 36.58 0 bottom
C46  100nF  [C0603]  25.03 49.16 180 top
C47  100nF  [C0603]  25.03 28.96 0 top
C48  100nF  [C0603]  52.97 28.96 0 top
C49  100nF  [C0603]  52.97 49.16 180 top
CN1  530480210  [CONN-TH_530480210]  25 44 0 bottom
CN5  530480210  [CONN-TH_530480210]  25.03 33.92 180 bottom
CN6  530480210  [CONN-TH_530480210]  53 34 180 bottom
CN7  530480210  [CONN-TH_530480210]  53 44 0 bottom
D2  SS34  [SMA_L4.3-W2.6-LS5.0-FD]  25.03 46.87 180 top
D3  SS34  [SMA_L4.3-W2.6-LS5.0-FD]  25.03 31.12 0 top
D4  SS34  [SMA_L4.3-W2.6-LS5.0-FD]  52.97 31.12 0 top
D5  SS34  [SMA_L4.3-W2.6-LS5.0-FD]  52.97 46.87 180 top
H1  -  [HDR-TH_4P-P2.54-V-F]  57.79 39 270 top
H2  -  [HDR-TH_2P-P2.54-V-F]  20.46 39 90 top
H3  -  [HDR-TH_2P-P2.54-V-F]  39 25.5 0 top
L2  8.2nH  [L0402]  39 53.98 0 top
L3  2.7nH  [L0402]  41.54 53.98 0 top
L5  3.9nH  [L0402]  35.95 53.85 180 top
L8  1.5nH  [L0603]  36.71 57.79 89.9 top
L9  2nH  [L0603]  39.25 58.55 0.7 top
LED1  GL0603UR01  [LED0603-FD]  33.28 22.1 0 top
LED2  GL0603UR01  [LED0603-FD]  40.01 30.61 270 top
Q2  CSD17318Q2  [WSON-6_L2.0-W2.0-P0.65-TL_CSD19538Q2]  26 41.5 0 top
Q3  CSD17318Q2  [WSON-6_L2.0-W2.0-P0.65-TL_CSD19538Q2]  26 36.5 180 top
Q4  CSD17318Q2  [WSON-6_L2.0-W2.0-P0.65-TL_CSD19538Q2]  52 36.5 180 top
Q5  CSD17318Q2  [WSON-6_L2.0-W2.0-P0.65-TL_CSD19538Q2]  52 41.5 0 top
R1  22kΩ  [R0603]  34.05 51.19 180 top
R2  100Ω  [R0603]  37.47 31.5 180 top
R3  100Ω  [R0603]  33.16 20.2 0 top
R4  1mΩ  [R0603]  47 48.01 90 bottom
R7  10kΩ  [R0603]  28.33 40.52 270 top
R8  33Ω  [R0603]  30.62 39.76 180 top
R9  10kΩ  [R0603]  28.33 37.47 90 top
R10  33Ω  [R0603]  30.62 38.23 180 top
R11  10kΩ  [R0603]  49.92 37.47 90 top
R12  33Ω  [R0603]  47.63 38.23 0 top
R13  10kΩ  [R0603]  49.92 40.52 270 top
R14  33Ω  [R0603]  47.63 39.76 0 top
SW2  MINI MSK12CO2  [SW-SMD_MSK12CO2]  39 21.34 0 top
U1  MPU-6050  [QFN-24_L4.0-W4.0-P0.50-BL-EP2.7]  39 39 90 bottom
U2  NRF24L01P-R  [QFN-20_L4.0-W4.0-P0.50-BL-EP]  39 50.17 0 top
U3  ADWH002  [ANT-SMD_L5.0-W2.0_HM5B]  39 62.49 0 top
U8  STM32F405RGT6  [LQFP-64_L10.0-W10.0-P0.50-LS12.0-BL]  39 39 180 top
U9  TPRT9069-33GB  [SOT-23-5_L3.0-W1.7-P0.95-LS2.8-BR]  44.21 25.03 90 top

## Footprints (pads in the part's own frame, mm; a bottom-side part is the same pattern mirrored in y, then rotated)
ANT-SMD_L5.0-W2.0_HM5B
  rect 0.7x2.3 smd: 1(-2.3,0) 2(2.3,0)
C0603
  rect 0.8x0.9 smd: 1(-0.7,0) 2(0.7,0)
C0805
  rect 1.41x1.35 smd: 1(-1,0) 2(1,0)
C1206
  rect 1.485x1.728 smd: 1(-1.593,0) 2(1.593,0)
CONN-TH_530480210
  rect 1x1 hole 0.6: 1(-0.625,0)
  round 1 hole 0.6: 2(0.625,0)
CRYSTAL-SMD_4P-L3.2-W2.5-BL
  rect 1.4x1.2 smd: 1(-1.1,-0.85) 2(1.1,-0.85) 3(1.1,0.85) 4(-1.1,0.85)
HDR-TH_2P-P2.54-V-F
  rect 1.7x1.7 hole 1: 1(-1.27,0)
  round 1.7 hole 1: 2(1.27,0)
HDR-TH_4P-P2.54-V-F
  rect 1.7x1.7 hole 1.1: 1(-3.81,0)
  round 1.7 hole 1.1: 2(-1.27,0) 3(1.27,0) 4(3.81,0)
L0402
  rect 0.54x0.54 smd: 1(-0.42,0) 2(0.42,0)
L0603
  rect 0.8x0.864 smd: 1(-0.7,0) 2(0.7,0)
LED0603-FD
  rect 0.9x1 smd: 1(-0.85,0) 2(0.85,0)
LQFP-64_L10.0-W10.0-P0.50-LS12.0-BL
  oval 0.3x1.5 smd: 1(-3.75,-5.688) 2(-3.25,-5.688) 3(-2.75,-5.688) 4(-2.25,-5.688) 5(-1.75,-5.688) 6(-1.25,-5.688) 7(-0.75,-5.688) 8(-0.25,-5.688) 9(0.25,-5.688) 10(0.75,-5.688) 11(1.25,-5.688) 12(1.75,-5.688) 13(2.25,-5.688) 14(2.75,-5.688) 15(3.25,-5.688) 16(3.75,-5.688) 33(3.75,5.688) 34(3.25,5.688) 35(2.75,5.688) 36(2.25,5.688) 37(1.75,5.688) 38(1.25,5.688) 39(0.75,5.688) 40(0.25,5.688) 41(-0.25,5.688) 42(-0.75,5.688) 43(-1.25,5.688) 44(-1.75,5.688) 45(-2.25,5.688) 46(-2.75,5.688) 47(-3.25,5.688) 48(-3.75,5.688)
  oval 1.5x0.3 smd: 17(5.7,-3.738) 18(5.7,-3.238) 19(5.7,-2.738) 20(5.7,-2.238) 21(5.7,-1.738) 22(5.7,-1.238) 23(5.7,-0.739) 24(5.7,-0.238) 25(5.7,0.262) 26(5.7,0.762) 27(5.7,1.262) 28(5.7,1.762) 29(5.7,2.261) 30(5.7,2.762) 31(5.7,3.261) 32(5.7,3.762) 49(-5.7,3.762) 50(-5.7,3.261) 51(-5.7,2.762) 52(-5.7,2.261) 53(-5.7,1.762) 54(-5.7,1.262) 55(-5.7,0.762) 56(-5.7,0.262) 57(-5.7,-0.238) 58(-5.7,-0.739) 59(-5.7,-1.238) 60(-5.7,-1.738) 61(-5.7,-2.238) 62(-5.7,-2.738) 63(-5.7,-3.238) 64(-5.7,-3.738)
OSC-SMD_4P-L3.2-W2.5-BL
  rect 1.4x1.2 smd: 1(-1.1,-0.875) 2(1.1,-0.875) 3(1.1,0.875) 4(-1.1,0.875)
QFN-20_L4.0-W4.0-P0.50-BL-EP
  rect 0.28x0.8 smd: 1(-1,-2) 2(-0.5,-2) 3(0,-2) 4(0.5,-2) 5(1,-2) 11(1,2) 12(0.5,2) 13(0,2) 14(-0.5,2) 15(-1,2)
  rect 0.8x0.28 smd: 6(2,-1) 7(2,-0.5) 8(2,0) 9(2,0.5) 10(2,1) 16(-2,1) 17(-2,0.5) 18(-2,0) 19(-2,-0.5) 20(-2,-1)
  rect 2.5x2.5 smd: 21(0,0)
QFN-24_L4.0-W4.0-P0.50-BL-EP2.7
  oval 0.28x0.8 smd: 1(-1.25,-2) 2(-0.75,-2) 3(-0.25,-2) 4(0.25,-2) 5(0.75,-2) 6(1.25,-2) 13(1.25,2) 14(0.75,2) 15(0.25,2) 16(-0.25,2) 17(-0.75,2) 18(-1.242,2)
  oval 0.8x0.28 smd: 7(2,-1.25) 8(2,-0.75) 9(2,-0.25) 10(2,0.25) 11(2,0.75) 12(2,1.25) 19(-2,1.25) 20(-2,0.75) 21(-2,0.25) 22(-2,-0.25) 23(-2,-0.75) 24(-2,-1.25)
  rect 2.7x2.7 smd: 25(0.013,0)
R0603
  rect 0.806x0.864 smd: 1(-0.753,0) 2(0.753,0)
SMA_L4.3-W2.6-LS5.0-FD
  rect 1.8x1.62 smd: 1(-2.15,-0.009) 2(2.15,0.009)
SOT-23-5_L3.0-W1.7-P0.95-LS2.8-BR
  rect 1.1x0.6 smd: 1(1.3,-0.95) 2(1.3,0) 3(1.3,0.95) 4(-1.3,0.95) 5(-1.3,-0.95)
SW-SMD_MSK12CO2
  rect 0.7x1.5 smd: 1(-1,1.45) 2(0,1.45) 3(1,1.45)
  rect 1x0.8 smd: 4(-2.75,0.75) 4(-2.75,-1.45) 5(2.75,0.75) 5(2.75,-1.45)
WSON-6_L2.0-W2.0-P0.65-TL_CSD19538Q2
  rect 0.45x0.35 smd: 1(-0.975,0.65) 2(-0.975,0) 3(-0.975,-0.65) 4(0.975,-0.65) 5(0.975,0.001) 6(0.975,0.65)
  rect 0.75x0.3 smd: 7(0.095,-0.65)
  rect 1x0.95 smd: 8(0,0.325)

## Nets
As in the schematic.

Pads without a net: SW2 3 4 5; U1 2 3 4 5 6 7 14 15 16 17 19 21 22; U8 2 3 4 7 8 16 17 20 21 22 24 25 27 28 29 30 33 35 37 38 44 45 50 51 52 53 54 56 57 59 61 62; U9 4

## Via types
v1: diameter 0.61, hole 0.305, Top Layer to Bottom Layer, 245 vias
v2: diameter 0.61, hole 0.35, Top Layer to Bottom Layer, 3 vias

## Routing (per net, layer and track width the routed paths; a pad name or vN(x,y) marks a point on that pad's centre or on a via; arc(x,y) is an arc through that point)
3.3V: length 126.2
  Top Layer w0.254: v1(44.76,42.84) 44.76,42.8 U8.64 ; U2.7 41.01,49.66 43.51,49.66 C7.1 ; 36.65,43.88 36.65,43.63 37.47,42.81 v1(37.98,42.81) ; 36.65,43.88 36.75,43.98 U8.13 ; 36.65,43.88 35.96,43.19 35.06,43.19 34.55,43.69 34.55,46.55 ; v1(48.59,32.39) 46.46,32.39 45.56,33.29 v1(45.4,33.29) ; 37.65,22.79 SW2.1 38,23.29 38.59,23.88 41.56,23.88 42.32,24.64 45.35,24.64 46.11,25.41 46.11,30.61 45.41,31.31 C29.2 v1(45.4,33.29) ; 37.65,22.79 37.42,22.79 33.22,26.99 33.22,32.9 33.3,32.98 U8.32 ; 37.65,22.79 37.03,22.17 37.03,21.58 36.16,20.71 34.42,20.71 R3.2 ; 34.55,46.55 C24.2 ; 34.55,46.55 31.19,43.19 C26.2 31.77,42.55 32.59,41.73 U8.19 ; C7.1 44.39,50.55 v1(44.39,50.61) ; C7.1 C6.1 44.08,48.2 44.08,46.23 45.41,44.9 v1(45.41,44.71) 42.78,44.71 U8.1 ; v1(45.4,33.29) 45.38,33.31 U8.48 ; U2.18 36.56,50.17 36.44,50.3 v1(36.08,50.3) ; U2.15 38,52.82 v1(37.86,52.97)
  Bottom Layer w0.254: 44.71,42.89 43.78,43.82 39.24,43.82 C3.2 ; 44.71,42.89 v1(44.76,42.84) 44.76,41.82 C4.1 42.43,40.25 U1.13 ; 44.71,42.89 44.71,44.01 v1(45.41,44.71) 45.41,33.3 v1(45.4,33.29) ; C3.2 38.25,42.78 U1.8 ; C3.2 v1(37.98,42.81) ; v1(44.39,50.61) 43.4,51.59 41.68,51.59 40.47,50.37 36.15,50.37 v1(36.08,50.3) 36.08,51.19 v1(37.86,52.97) ; H1.4 55,32.39 v1(48.59,32.39)
GND: length 7.6
  Top Layer w0.254: U8.12 37.32,44.61 37.32,43.91 37.57,43.65 38.28,43.65 39.25,42.68 39.38,42.68
  Top Layer w0.75: U3.2 41.3,58.3
  vias: v1(19.95,45.85) v1(19.95,45.09) v1(20.2,32.65) v1(20.2,31.88) v1(20.62,45.85) v1(20.67,45.09) v1(20.87,32.65) v1(20.92,31.88) v1(21.24,35.19) v1(21.24,34.42) v1(21.37,43.06) v1(21.37,42.3) v1(21.91,35.19) v1(22.04,43.06) v1(21.96,34.42) v1(22.09,42.3) v1(23.57,54.56) v1(23.57,53.91) v1(24.21,54.56) v1(24.21,53.91) v1(25.03,46.89) v1(25.03,39.12) v1(25.03,38.49) v1(25.04,31.16) v1(25.48,51.13) v1(25.47,50.48) v1(26.11,51.13) v1(26.11,50.48) v1(26.93,27.06) v1(26.93,26.3) v1(27.06,39.12) v1(27.06,38.49) v1(27.51,53.29) v1(27.5,52.64) v1(27.56,33.53) v1(27.6,27.06) v1(27.65,26.3) v1(28.14,53.29) v1(28.14,52.64) v1(28.2,32.9) v1(28.33,41.31) v1(28.33,36.67) v1(28.71,35.11) v1(28.71,32.39) v1(29.22,31.88) v1(29.29,36.58) v1(29.35,29.09) v1(29.35,28.33) v1(29.37,41.44) v1(29.73,57.66) v1(29.73,48.14) v1(29.73,47.38) v1(29.79,42.55) v1(29.9,31.11) v1(29.85,25.15) v1(29.85,24.39) v1(29.97,34.93) v1(30.02,29.09) v1(30.11,33.79) v1(30.07,28.33) v1(30.36,58.17) v1(30.4,48.14) v1(30.45,47.38) v1(30.52,25.15) v1(30.62,30.36) v1(30.57,24.39) v1(30.74,33.28) v1(31.04,41.09) v1(31.04,36.58) v1(31.12,29.72) v1(31.22,58.16) v1(31.69,33.03) v1(31.76,29.09) v1(32.14,31.76) v1(32.18,58.17) v1(32.27,28.45) v1(33.28,55.38) v1(33.37,58.3) v1(33.37,57.43) v1(33.37,56.38) v1(33.66,54.49) v1(33.92,29.98) v1(33.92,27.18) v1(34.05,53.73) v1(34.08,22.1) v1(34.17,52.95) v1(34.42,57.43) v1(34.42,56.54) v1(34.43,26.68) v1(34.48,58.35) v1(34.55,29.34) v1(34.93,26.17) v1(35.06,52.82) v1(35.19,28.71) v1(35.32,58.3) v1(35.44,57.41) v1(35.44,56.54) v1(35.44,25.66) v1(35.7,41.03) v1(35.7,39.98) v1(35.7,38.62) v1(35.82,28.2) v1(35.95,25.15) v1(36.22,42.64) v1(36.46,27.57) v1(37.6,27.18) v1(37.98,57.03) v1(38.11,51.06) v1(38.24,49.79) v1(38.3,39.83) v1(38.69,27.82) v1(39,51.06) v1(39,20.87) v1(39.14,28.49) v1(39.74,51.06) v1(39.79,49.79) v1(39.76,38.23) v1(39.95,58.43) v1(40.04,29.71) v1(40.08,55.51) v1(40.27,53.09) v1(40.9,26.8) v1(41.3,58.55) v1(41.3,57.25) v1(41.26,30.41) v1(41.55,47.65) v1(41.67,26.93) v1(41.92,47) v1(42.3,57.28) v1(42.3,56.01) v1(42.33,52.68) v1(42.3,28.71) v1(42.39,58.43) v1(43.21,57.28) v1(43.21,56.01) v1(43.32,58.17) v1(43.64,31.5) v1(43.89,22.1) v1(44.23,58.3) v1(44.21,57.28) v1(44.23,56.01) v1(44.21,26.55) v1(44.83,32.01) v1(45.21,46.79) v1(45.24,20.2) v1(45.34,58.26) v1(45.35,57.28) v1(46.56,58.3) v1(46.62,35.82) v1(46.78,33.28) v1(46.88,36.62) v1(46.87,30.49) v1(47.51,31.12) v1(47.79,34.4) v1(47.89,24.64) v1(47.89,24.01) v1(48.02,31.63) v1(48.52,29.34) v1(48.52,28.58) v1(48.58,24.64) v1(48.58,24.01) v1(48.88,41.3) v1(48.9,30.36) v1(48.96,36.58) v1(49.19,29.34) v1(49.24,28.58) v1(49.92,36.67) v1(50.05,41.27) v1(50.65,37.48) v1(51.24,39.63) v1(51.19,27.31) v1(51.76,52.4) v1(51.76,51.75) v1(51.86,27.31) v1(52.4,52.4) v1(52.4,51.75) v1(52.53,56.09) v1(52.52,55.43) v1(52.97,46.69) v1(52.97,31.11) v1(53.16,56.09) v1(53.16,55.43) v1(53.42,25.35) v1(53.41,24.7) v1(53.73,37.57) v1(54.11,40.01) v1(54.11,38.23) v1(54.05,25.35) v1(54.05,24.7) v1(54.24,40.65) v1(54.58,27.18) v1(54.78,27.95) v1(54.89,36.2) v1(54.89,35.44) v1(55.15,42.68) v1(55.15,41.92) v1(55.25,26.8) v1(55.45,53.8) v1(55.44,53.15) v1(55.38,27.44) v1(55.57,36.2) v1(55.61,35.44) v1(55.82,42.68) v1(55.87,41.92) v1(55.87,40.01) v1(56.08,53.8) v1(56.08,53.15) v1(56.06,38.23) v1(57.03,47.12) v1(57.03,46.36) v1(57.05,31.63) v1(57.05,30.87) v1(57.7,47.12) v1(57.72,31.63) v1(57.75,46.36) v1(57.77,30.87) v2(44.36,27.24) v2(45.01,27.82) v2(45.53,28.22)
VIN: length 10.5
  Top Layer w0.254: U9.5 45.16,22.24 C33.2 45.29,21.6 C32.1 43.51,20.57 41.98,20.57 40.83,21.72 39.45,21.72 39,22.17 SW2.2
M1: length 1.9
  Top Layer w0.254: R8.1 31.39,39.73 U8.23
M2: length 2.2
  Top Layer w0.254: R14.1 46.86,39.73 U8.58
M3: length 2.2
  Top Layer w0.254: U8.55 R12.1
M4: length 1.9
  Top Layer w0.254: U8.26 R10.1
MISO: length 4.2
  Top Layer w0.254: U2.5 40,47.73 38.25,45.98 U8.10
MOSI: length 4.2
  Top Layer w0.254: U8.11 37.75,45.98 39.5,47.73 U2.4
MPUINT: length 10.5
  Top Layer w0.254: v1(37.09,36.96) 40.9,40.77 v1(40.9,41.03) ; v1(37.15,34.94) 37.75,34.34 37.93,34.34 38.25,34.01 U8.39
  Bottom Layer w0.254: U1.12 40.28,41.03 v1(40.9,41.03) ; v1(37.09,36.96) 37.09,34.99 v1(37.15,34.94)
MPUSCL: length 4.1
  Top Layer w0.254: v1(38.9,34.97) 39.25,34.62 U8.41
  Bottom Layer w0.254: U1.23 38.24,36.98 38.24,35.63 v1(38.9,34.97)
MPUSDA: length 4.1
  Top Layer w0.254: v1(38.09,34.95) 38.75,34.29 U8.40
  Bottom Layer w0.254: v1(38.09,34.95) 37.75,35.29 U1.24
NRFCON: length 5.2
  Top Layer w0.254: U2.2 38.5,47.74 37.89,47.12 36.84,47.12 35.77,46.06 35.77,44.71 U8.15
NRFIRQ: length 5.4
  Top Layer w0.254: U2.6 40.42,48.59 40.42,47.64 38.75,45.97 U8.9
NRFMODE: length 4.3
  Top Layer w0.254: U8.14 36.25,45.64 v1(36.59,45.98) ; U2.1 37.71,47.89 v1(37.6,47.89)
  Bottom Layer w0.254: v1(37.6,47.89) 36.59,46.87 v1(36.59,45.98)
NRFSCK: length 17.2
  Top Layer w0.254: U8.34 35.75,34.01 34.82,34.94 v1(34.82,36.47) ; v1(37.33,46.44) 37.7,46.44 38.92,47.65 38.92,47.68 39,47.76 U2.3
  Bottom Layer w0.254: v1(37.33,46.44) 37.33,45.69 34.82,43.18 v1(34.82,36.47)
RX: length 34.5
  Top Layer w0.254: U8.43 40.25,35.21 39.51,35.95 36.07,35.95 v1(35.91,35.79)
  Bottom Layer w0.254: H2.1 20.58,37.85 20.84,37.85 22.74,39.76 22.74,44.84 23.76,45.85 27.91,45.85 32.27,41.5 32.27,38.19 34.58,35.88 35.06,35.88 35.1,35.92 35.79,35.92 v1(35.91,35.79)
SWCLK: length 21.1
  Top Layer w0.254: v1(49.79,44.58) 49.17,44.58 v1(45.99,41.41) ; v1(45.99,36.96) 45.99,35.82 45.41,35.23 U8.49
  Bottom Layer w0.254: v1(45.99,36.96) v1(45.99,41.41) ; v1(49.79,44.58) 49.98,44.77 55.83,44.77 H1.1
SWDIO: length 21
  Top Layer w0.254: U8.46 41.75,34.01 42.16,34.42 46.24,34.42 47.56,35.75 47.56,38.64 47.97,39.05 v1(53.18,39.05) ; v1(56.6,39.05) 56.6,39.07 H1.2
  Bottom Layer w0.254: v1(53.18,39.05) v1(56.6,39.05)
TX: length 32.5
  Top Layer w0.254: v1(36.15,34.95) 36.77,35.57 39.25,35.57 39.75,35.07 U8.42 ; H2.2 20.58,40.39 v1(23.33,40.39)
  Bottom Layer w0.254: v1(36.15,34.95) 35.89,35.21 34.28,35.21 31.91,37.58 31.91,41.35 27.89,45.37 24.35,45.37 23.25,44.27 23.25,40.47 v1(23.33,40.39)
VM: length 94.4
  Top Layer w0.5: 43.46,27.9 40.48,27.9 37.73,25.15 37.73,24.9 ; 43.46,27.9 43.26,27.7 U9.3 43.26,25.86 43.76,25.36 44.66,25.36 45.16,25.86 U9.1 ; 43.46,27.9 C18.2
  Top Layer w0.8: C46.2 22.88,47.71 D2.2 22.88,45.49 CN1.1 ; CN7.1 50.82,45.55 D5.2 50.82,47.71 C49.2 ; C47.2 27.18,30.41 D3.2 27.18,32.39 CN5.1 ; C48.2 55.12,30.41 D4.2 55.12,32.5 CN6.1
  Bottom Layer w0.9: CN7.1 52.37,41.51 C42.2 C44.2 ; C40.2 26.1,36.35 36.96,25.5 H3.1 41.96,29.72 44.63,29.72 51.49,36.58 C44.2 ; C40.2 25.65,36.13 CN5.1 ; C40.2 C38.2 24.37,43.14 CN1.1 ; C44.2 53.62,35.11 CN6.1
$1N574: length 1.9
  Bottom Layer w0.254: U1.20 39.76,36.98 39.76,35.84 C2.1
$1N1185: length 2.2
  Top Layer w0.254: R1.1 34.82,51.17 U2.16
$1N1316: length 2.3
  Top Layer w0.254: C5.1 34.87,49.66 36.99,49.66 U2.19
$1N2240: length 4.2
  Top Layer w0.254: L5.1 36.47,53.95 38.55,53.95 L2.1 38.58,53.39 39,52.97 U2.13
$1N2242: length 1.6
  Top Layer w0.254: L5.2 35.53,55.1 C8.1
$1N2285: length 3.6
  Top Layer w0.254: 39.66,53.97 39.43,53.97 L2.2 ; 39.66,53.97 39.5,53.81 U2.12 ; 39.66,53.97 41.11,53.97 L3.1
$1N2301: length 7
  Top Layer w0.254: C11.2 44.01,54.11 C35.2 43.63,53.98 L3.2 41.96,53.77 40.36,52.17 U2.11
$1N7003: length 2.6
  Bottom Layer w0.254: C1.2 40.26,42.81 39.25,41.79 U1.10
$1N7186: length 13.7
  Top Layer w0.254: U8.6 40.25,45.39 40.23,45.41 v1(40.23,46.59)
  Bottom Layer w0.254: v1(40.23,46.59) 40.23,47.16 38.66,48.74 36.3,48.74 35.57,48.01 34.27,48.01 33.15,46.9 8mhz.1 31.6,45.35 C20.1
$1N7190: length 13.6
  Top Layer w0.254: v1(41.03,46.62) 41.03,45.67 40.75,45.39 U8.5
  Bottom Layer w0.254: C21.2 32.4,50.04 32.43,50.07 33.87,50.07 8mhz.3 38.8,49.1 40.59,47.31 40.59,47.06 v1(41.03,46.62)
$1N10822: length 2.3
  Top Layer w0.254: U8.31 32.12,35.73 C30.1
$1N10858: length 1.8
  Top Layer w0.254: U8.47 42.25,31.52 42.24,31.5
$1N11078: length 1.8
  Top Layer w0.254: R2.1 39.98,31.5 LED2.1
$1N11191: length 1.9
  Top Layer w0.254: R3.1 32.4,22.07 LED1.1
$1N19913: length 1.8
  Top Layer w0.254: R2.2 36.75,31.53 U8.36
$1N21756: length 3.8
  Top Layer w0.75: C34.1 38.55,55.38 C8.2 36.65,57.03 L8.1
$1N25381: length 11.1
  Top Layer w0.254: U2.9 41.43,50.67 41.76,50.35 ; 41.76,50.35 v1(41.86,50.25)
  Bottom Layer w0.254: v1(41.86,50.25) 41.92,50.18 41.92,48.1 16mhz.1 43.18,46.9 44.6,45.47 C36.2 47,45.54 R4.1
$1N25386: length 9
  Top Layer w0.254: v1(41.99,51.01) 41.83,51.17 U2.10
  Bottom Layer w0.254: R4.2 47,50.36 C37.2 46.2,50.43 16mhz.3 42.96,51.01 v1(41.99,51.01)
$1N52195: length 5.9
  Top Layer w0.75: U3.1 36.71,62.48 L8.2 38.5,58.49 L9.1
$1N63479: length 5.6
  Top Layer w0.254: R8.2 28.34,39.76 R7.2 25.6,39.77 25.02,40.35 Q2.3
$1N64362: length 13.2
  Top Layer w0.35: Q2.6 26.32,42.15 Q2.8 ; Q2.8 26.27,41.82 26.59,41.5 Q2.5 ; Q2.8 25.67,42.15 Q2.1 ; Q2.8 25.67,41.5 Q2.2
  Top Layer w0.8: CN1.2 27.18,45.55 D2.1 27.18,47.71 C46.1
  Top Layer w0.9: Q2.8 26,43.62 CN1.2
$1N64796: length 3.5
  Top Layer w0.254: Q3.3 26.97,37.35 27.27,37.65 27.75,37.65 R9.2 28.34,38.23 R10.2
$1N64805: length 13.1
  Top Layer w0.35: Q3.6 25.67,35.85 ; Q3.1 26.32,35.85 Q3.8 ; Q3.8 26.32,36.5 Q3.2 ; Q3.8 25.67,36.5 Q3.5
  Top Layer w0.8: C47.1 22.88,30.41 D3.1 22.88,32.39 CN5.2
  Top Layer w0.9: CN5.2 24.4,34.58 Q3.8
$1N65508: length 3.4
  Top Layer w0.254: Q5.3 51.02,40.35 50.44,39.77 R13.2 49.91,39.76 R14.2
$1N65517: length 12.7
  Top Layer w0.35: Q5.8 51.67,42.15 Q5.1 ; Q5.8 52.32,41.5 Q5.5 ; Q5.8 51.67,41.5 Q5.2
  Top Layer w0.8: CN7.2 55.12,45.49 D5.1 55.12,47.71 C49.1
  Top Layer w0.9: CN7.2 53.62,43.21 52.24,41.82 Q5.8
$1N65864: length 5.3
  Top Layer w0.254: R12.2 49.91,38.23 R11.2 52.39,38.23 52.97,37.65 Q4.3
$1N65873: length 13
  Top Layer w0.35: Q4.8 52.32,36.5 Q4.2 ; Q4.8 52.32,35.85 Q4.1 ; Q4.8 51.67,36.5 Q4.5 ; Q4.8 51.67,35.85 Q4.6
  Top Layer w0.8: C48.1 50.82,30.41 D4.1 50.82,32.44 CN6.2
  Top Layer w0.9: CN6.2 52,34.37 Q4.8

## Copper pours and planes (outline as drawn; the poured copper is in the pictures)
GND on Top Layer: -0.37,78.11 78.62,78.11 78.62,-0.37 -0.37,-0.37
GND on Bottom Layer: -0.37,78.11 77.86,78.11 77.86,-0.25 -0.37,-0.25

## Text on the board
Bottom Silkscreen Layer: MPU | M4 | M3 | M1 | M2
Top Silkscreen Layer: NRF | LDO | RX | TX | + | F405 | - | T | F | C | Y
